# EAGLE design LiPoBBSupplyWithCharging (EAGLE 8.1.1)
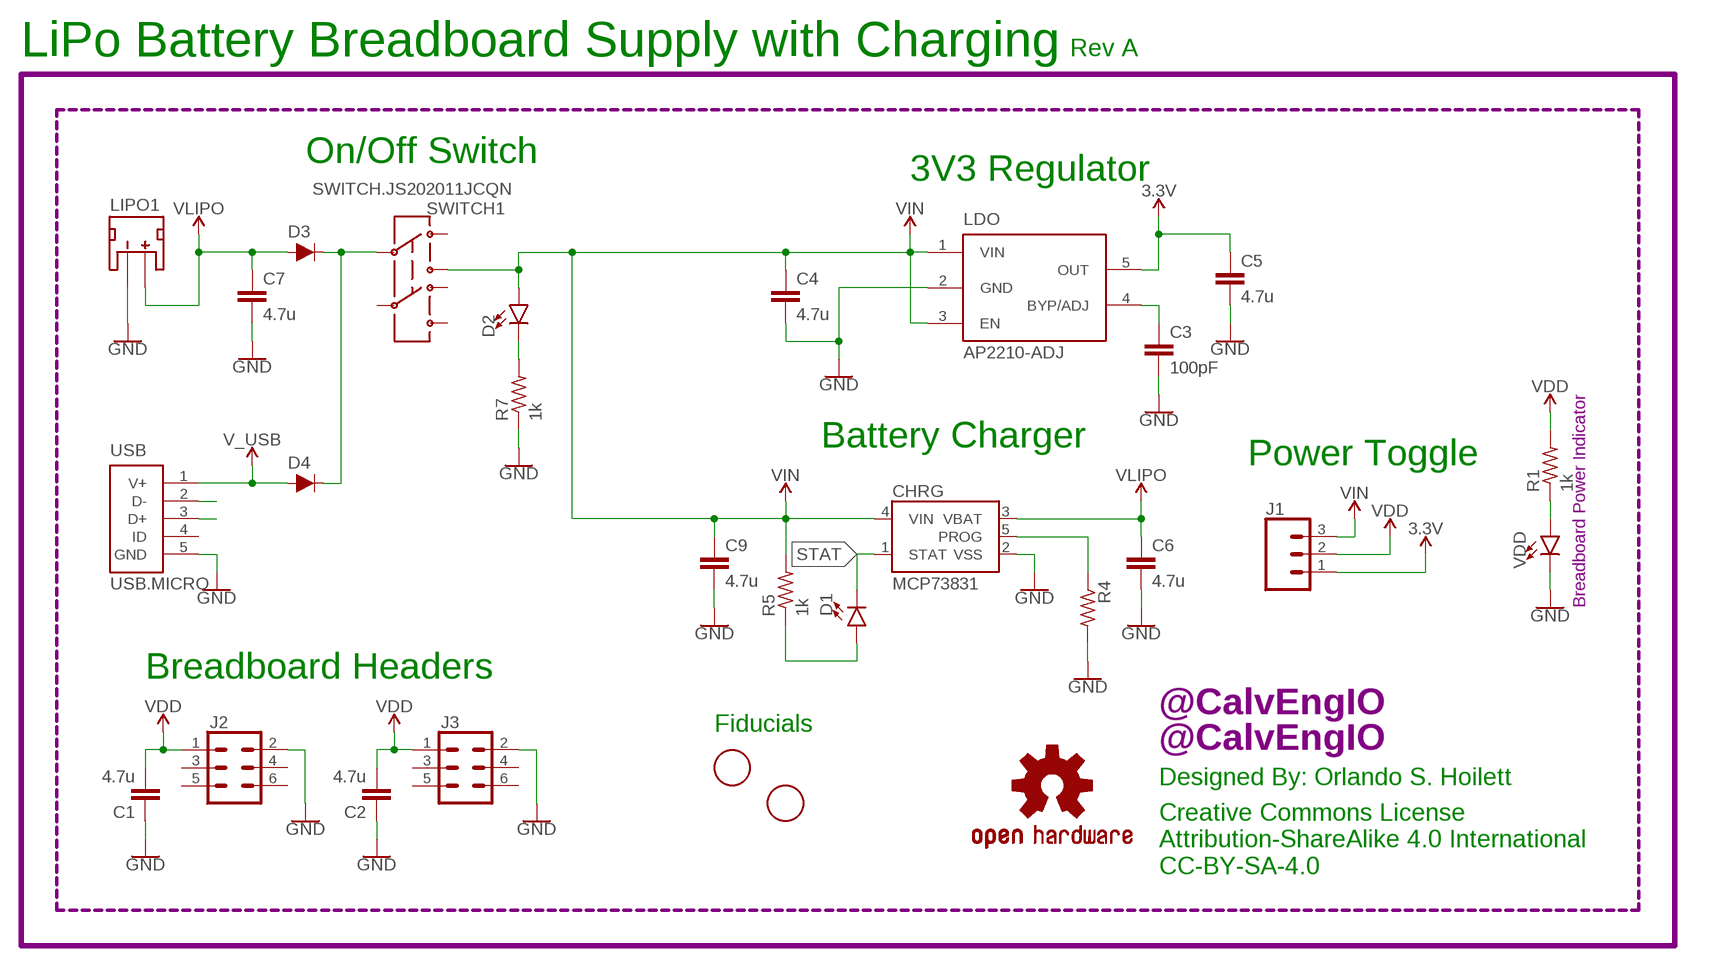
[diagram p0: schematic, sheet 1]

## Parts
C1  4.7u  CAPACITOR0603  [C0603]
C2  4.7u  CAPACITOR0603  [C0603]
C3  100pF  C-EUC0402  [C0402]
C4  4.7u  CAPACITOR0603  [C0603]
C5  4.7u  CAPACITOR0603  [C0603]
C6  4.7u  CAPACITOR0603  [C0603]
C7  4.7u  CAPACITOR0603  [C0603]
C9  4.7u  CAPACITOR0603  [C0603]
CHRG  MCP73831  [SOT23-5]
D1  LED0603  [LED-0603]
D2  LED0603  [LED-0603]
D3  DIODE-BAS16J  [SOD-323]
D4  DIODE-BAS16J  [SOD-323]
FD1  FIDUCIAL  [FIDUCIAL_1MM]
FD2  FIDUCIAL  [FIDUCIAL_1MM]
J1  CONN_03  [1X03]
J2  CONN_03X22X3_SILK_MALE_PTH  [2X3]
J3  CONN_03X22X3_SILK_MALE_PTH  [2X3]
LDO  AP2210-ADJ  [SOT23-5]
LIPO1  JST_2MM_MALE  [JST-2-SMD]
LOGO1  OSHW-LOGOS  [OSHW-LOGO-S]
R1  1k  R-US_R0402  [R0402]
R4  RESISTOR0402  [R0402]
R5  1k  RESISTOR0402  [R0402]
R7  1k  RESISTOR0402  [R0402]
SWITCH1  SWITCH.JS202011JCQN  [SWITCH.00]
U$1  HANDLE.1HANDLE.025  [HANDLE.025]
U$3  CALVENGIO_HANDLEHANDLE.1  [CALVENGIO_HANDLE.1]
USB  USB.MICRO  [USB-MICRO-01]
VDD  LED0603  [LED-0603]

## Nets
3.3V: C5.1 J1.1 LDO.5(OUT)
GND: C1.1 C2.1 C3.2 C4.2 C5.2 C6.2 C7.2 C9.2 CHRG.2(VSS) J2.2 J3.2 LDO.2(GND) LIPO1.1(-) R4.2 R7.1 USB.5(GND) VDD.C
N$2: R1.1 VDD.A
N$3: D2.C R7.2
N$4: C3.1 LDO.4(BYP/ADJ)
N$6: D1.A R5.1
N$8: CHRG.5(PROG) R4.1
N$9: D3.C D4.C SWITCH1.2
N$13: USB.3(D+)
N$17: USB.2(D-)
STAT: CHRG.1(STAT) D1.C
V_USB: D4.A USB.1(V+)
VDD: C1.2 C2.2 J1.2 J2.1 J3.1 R1.2
VIN: C4.1 C9.1 CHRG.4(VIN) D2.A J1.3 LDO.1(VIN) LDO.3(EN) R5.2 SWITCH1.3
VLIPO: C6.1 C7.1 CHRG.3(VBAT) D3.A LIPO1.2(+)
Unconnected: J2.3 J2.4 J2.5 J2.6 J3.3 J3.4 J3.5 J3.6 LIPO1.NC1(PAD1) LIPO1.NC2(PAD2) SWITCH1.1 SWITCH1.5 SWITCH1.6 SWITCH1.7 USB.4(ID)

## Notes on the sheet
- LiPo Battery Breadboard Supply with Charging | Rev A
- On/Off Switch
- 3V3 Regulator
- Battery Charger
- Power Toggle
- Breadboard Power Indicator
- Breadboard Headers
- Fiducials
- Designed By: Orlando S. Hoilett
- Creative Commons License
  Attribution-ShareAlike 4.0 International
  CC-BY-SA-4.0

## Library data of the parts
C1 C2 C4-C7 C9 = CalvEngIO-Passives:CAPACITOR
C3 = resistor:C-EU: CAPACITOR, European symbol
CHRG = CalvEngIO-Power:MCP73831: MCP73831T Li-Ion, Li-Pol Controller Miniature single cell, fully integrated Li-Ion, Li-polymer charge management controller Datasheet <http://ww1.microchip.com/downloads/en/DeviceDoc/20001984g.pdf> SparkFun Products: SparkFun ESP32 Thing <https://www.sparkfun.com/products/13907> SparkFun 9DoF Razor IMU M0 <https://www.sparkfun.com/products/14001>; PROD_ID: IC-09995
D1 D2 VDD = CalvEngIO-LED:LED: LED (Generic) Standard schematic elements and footprints for 5mm, 3mm, 1206, and 0603 sized LEDs. Generic LEDs with no color specified.
D3 D4 = CalvEngIO-DiscreteSemi:DIODE: Diode These are standard reverse protection diodes and small signal diodes. SparkFun Products: SparkFun SparkPunk Sound Kit <https://www.sparkfun.com/products/11177> SparkFun ESP8266 Thing <https://www.sparkfun.com/products/13231>; PROD_ID: DIO-09646
FD1 FD2 = adafruit:FIDUCIAL: For use by pick and place machines to calibrate the vision/machine, 1mm By microbuilder.eu
J1 = SparkFun-Connectors:CONN_03: Multi connection point. Often used as Generic Header-pin footprint for 0.1 inch spaced/style header connections On any of the 0.1 inch spaced packages, you can populate with these: Break Away Headers - Straight <https://www.sparkfun.com/products/116> (PRT-00116) Break Away Male Headers - Right Angle <https://www.sparkfun.com/products/553> (PRT-00553) Female Headers <https://www.sparkfun.com/products/115> (PRT-00115) Break Away Headers - Machine Pin <https://www.sparkfun.com/products/117> (PRT-00117) Break Away Female Headers - Swiss Machine Pin <https://www.sparkfun.com/products/743> (PRT-00743) Stackable Header - 3 Pin (Female, 0.1") <https://www.sparkfun.com/products/13875> (PRT-13875) For SCREWTERMINALS and SPRING TERMINALS visit here: Screw Terimnals on SparkFun.com <https://www.sparkfun.com/search/results?term=Screw+Terminals> (5mm/3.5mm/2.54mm spacing) This device is also useful as a general connection point to wire up your design to another part of your project. Our various solder wires solder well into these plated through hole pads. Hook-Up Wire - Assortment (Stranded, 22 AWG) <https://www.sparkfun.com/products/11375> (PRT-11375) Hook-Up Wire - Assortment (Solid Core, 22 AWG) <https://www.sparkfun.com/products/11367> (PRT-11367) View the entire wire category on our website here <https://www.sparkfun.com/categories/141> Special notes: Molex polarized connector foot print use with SKU : PRT-08232 with associated crimp pins and housings.
J2 J3 = CalvEngIO-Connectors:CONN_03X2: Multi connection point. Often used as Generic Header-pin footprint for 0.1 inch spaced/style header connections You can populate with any combo of single row headers, but if you'd like an exact match, check these: Header - 2x3 (Male, 0.1") <https://www.sparkfun.com/products/12807> (PRT-12807) Header - 2x3 (Female, 0.1") <https://www.sparkfun.com/products/13010> (PRT-13010) 2x3 Pin Shrouded Header <https://www.sparkfun.com/products/10877> (PRT-10877) On any of the 0.1 inch spaced packages, you can populate with these: Break Away Headers - Straight <https://www.sparkfun.com/products/116> (PRT-00116) Break Away Male Headers - Right Angle <https://www.sparkfun.com/products/553> (PRT-00553) Female Headers <https://www.sparkfun.com/products/115> (PRT-00115) Break Away Headers - Machine Pin <https://www.sparkfun.com/products/117> (PRT-00117) Break Away Female Headers - Swiss Machine Pin <https://www.sparkfun.com/products/743> (PRT-00743) Special note: the shrouded connector mates well with our 3x2 ribbon cables: Ribbon Crimp Connector - 6-pin (2x3, Female) <https://www.sparkfun.com/products/10651> (PRT-10651) Ribbon Cable - 6 wire (15ft) <https://www.sparkfun.com/products/10646> (PRT-10646); PROD_ID: CONN-09701
LDO = CalvEngIO-Power:AP2210-ADJ
LIPO1 = CalvEngIO-Connectors:JST_2MM_MALE: JST 2MM MALE RA CONNECTOR Two pin, compact surface mount connector. Commonly used as a battery input connection point. We really like the solid locking feeling and high current rating on these small connectors. We use these all the time as battery connectors. Mates to single-cell LiPo batteries. Here is the connector we sell at SparkFun: JST Right Angle Connector - White <https://www.sparkfun.com/products/8612> (PRT-08612) Datasheet <http://www.sparkfun.com/datasheets/Prototyping/Connectors/JST-Horizontal.pdf> It was used on these SparkFun products: SparkFun MOSFET Power Controller <https://www.sparkfun.com/products/11214> (PRT-11214) SparkFun Battery Babysitter - LiPo Battery Manager <https://www.sparkfun.com/products/13777> (PRT-13777) And many, many others that required a lipo battery connection.; PROD_ID: CONN-11443; SF_ID: PRT-08612
LOGO1 = SparkFun-Aesthetics:OSHW-LOGO: Open-Source Hardware (OSHW) Logo This logo indicates the piece of hardware it is found on incorporates a OSHW license and/or adheres to the definition of open source hardware found here: http://freedomdefined.org/OSHW
R1 = resistor:R-US_: RESISTOR, American symbol
R4 R5 R7 = CalvEngIO-Passives:RESISTOR
SWITCH1 = CalvEngIO-Switches:SWITCH.JS202011JCQN
U$1 = CalvEngIO-Logos:HANDLE.1
U$3 = CalvEngIO-Logos:CALVENGIO_HANDLE
USB = CalvEngIO-Connectors:USB.MICRO: DigiKey PN: 609-4613-1-ND

## Board
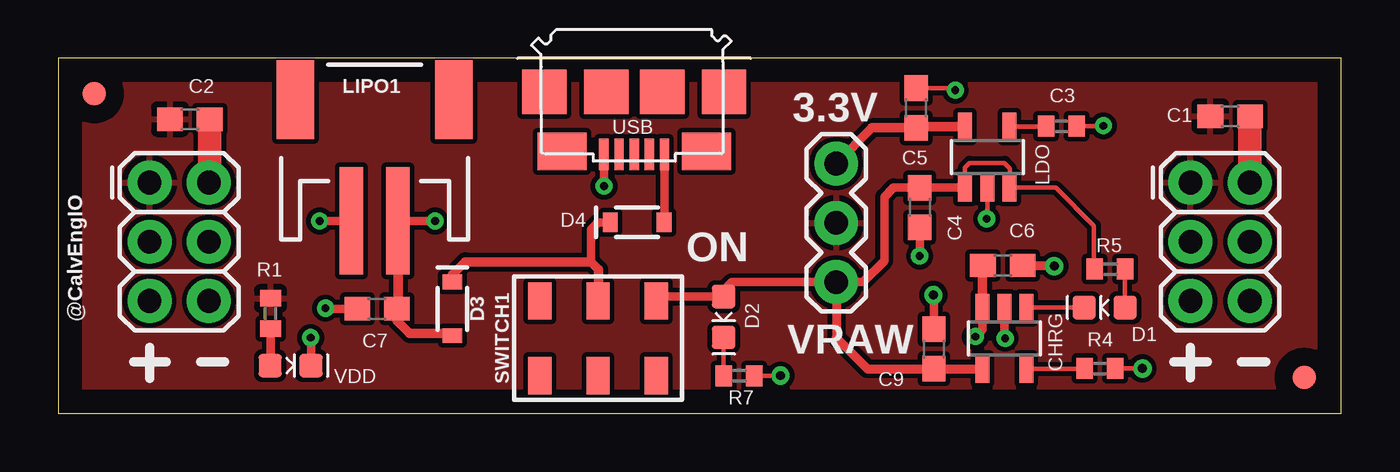
[diagram p1: board, top side]
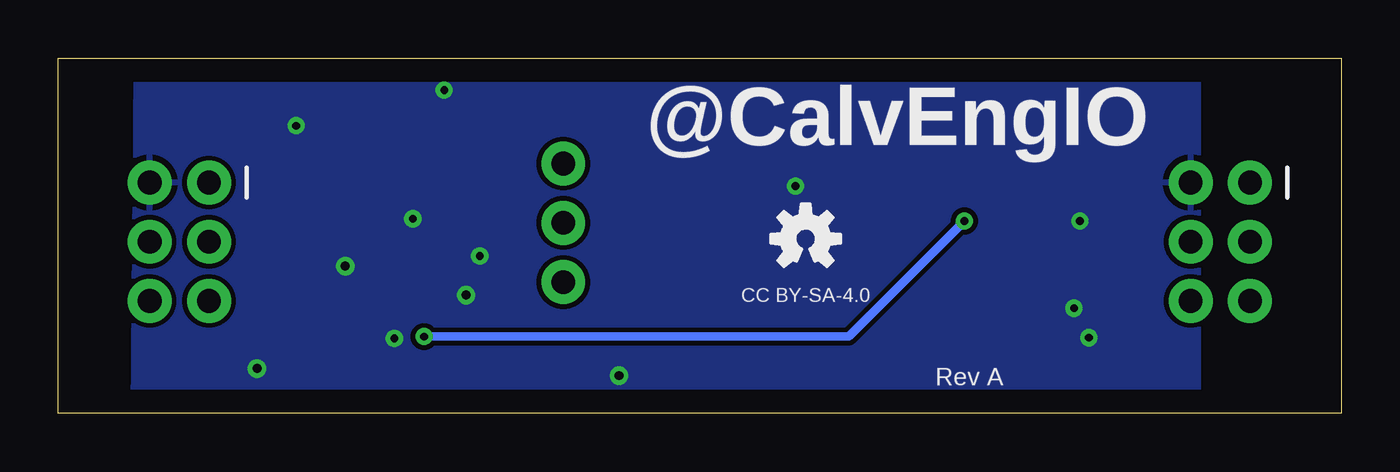
[diagram p2: board, bottom side, seen from below]

Size 55 x 15.24 mm. Coordinates in mm from the lower left corner, seen from the top.
Outline: 0,0 55,0 55,15.24 0,15.24 0,0
Copper layers (1*16): Top 0.035mm / dielectric 1.5mm / Bottom 0.035mm
Design rules "default": minimum track width 10mil, minimum drill 24mil, track to track 8mil, track to pad 8mil, pad to pad 8mil, via to via 8mil, smd to smd 8mil, copper to edge 40mil, drill to drill 8mil, minimum pad ring 10mil, minimum via ring 8mil, stop-mask expansion 4mil, vias tented up to drill 0mil, thermal gap 10mil

### Footprints (pad centres in the part's own frame; a part is rotated, then mirrored left to right if it is on the bottom)
C0603 = smd 1.1 x 1: 1 -0.85,0; 2 0.85,0
C0402 = smd 0.7 x 0.9: 1 -0.65,0; 2 0.65,0
SOT23-5 = smd 0.6 x 1.2: 1 -0.95,-1.306; 2 0,-1.306; 3 0.95,-1.306; 4 0.95,1.306; 5 -0.95,1.306
LED-0603 = smd 1 x 1: A -0.877,0; C 0.877,0
SOD-323 = smd 0.63 x 0.83: A 1.15,0; C -1.15,0
FIDUCIAL_1MM = smd 1 x 1: 1 0,0
1X03 = drill 1.016 pad 1.88: 1 0,0; 2 2.54,0; 3 5.08,0
2X3 = drill 1.016 pad 1.88: 1 0,0; 2 0,2.54; 3 2.54,0; 4 2.54,2.54; 5 5.08,0; 6 5.08,2.54
JST-2-SMD = smd 1 x 4.6: 1 -1,-3.7; 2 1,-3.7 | smd 1.6 x 3.4: NC1 -3.4,1.5; NC2 3.4,1.5
R0402 = smd 0.7 x 0.9: 1 -0.65,0; 2 0.65,0
SWITCH.00 = smd 1 x 1.6: 1 -2.5,1.6; 2 0,1.6; 3 2.5,1.6; 5 -2.5,-1.6; 6 0,-1.6; 7 2.5,-1.6
USB-MICRO-01 = smd 0.4 x 1.35: 1 -1.3,2.675; 2 -0.65,2.675; 3 0,2.675; 4 0.65,2.675; 5 1.3,2.675 | smd 1.9 x 1.9: SOLDER-1 -3.85,0; SOLDER-2 -1.2,0; SOLDER-3 1.2,0; SOLDER-4 3.85,0 | smd 2.1 x 1.6: SOLDER-5 -3.1,2.55; SOLDER-6 3.1,2.55

### Placement (x,y rotation side)
C1  50.24,12.75 180 top
C2  5.64,12.62 180 top
C3  43,12.32 0 top
C4  36.93,8.84 270 top
C5  36.78,13.11 90 top
C6  40.49,6.35 0 top
C7  13.67,4.5 180 top
C9  37.54,2.77 90 top
CHRG  40.56,3.23 180 top
D1  44.86,4.55 180 top
D2  28.52,4.14 270 top
D3  16.89,4.5 270 top
D4  24.82,8.2 0 top
FD1  1.55,13.72 0 top
FD2  53.42,1.55 0 top
J1  33.35,10.72 270 top
J2  3.91,9.91 270 top
J3  48.54,9.91 270 top
LDO  39.83,11 0 top
LIPO1  13.56,11.96 0 top
LOGO1  22.96,7.49 0 bottom
R1  9.09,4.29 90 top
R4  44.65,1.93 0 top
R5  45.09,6.2 180 top
R7  29.18,1.63 180 top
SWITCH1  23.14,3.23 0 top
U$1  0.41,6.86 270 top
U$3  19.66,12.78 0 bottom
USB  24.69,13.79 180 top
VDD  9.96,2.06 0 top

### Tracks (layer width: path | path; a pad name or v marks a point on that pad's centre or on a via)
3.3V
  Top 0.406: LDO.5 36.83,12.3 C5.1 34.89,12.26 J1.1
GND  (via drill 0.33, 0.38)
  Top 0.203: R7.1 v30.96,1.63 | R4.2 v46.48,1.93 | C3.2 44.78,12.32 v44.81,12.34 | C5.2 38.37,13.96 v38.46,13.87 | LDO.2 39.83,8.38 v39.8,8.36
  Top 0.356: CHRG.2 40.56,3.25 v40.59,3.23 | C9.2 37.54,5.05 v37.52,5.08 | C4.2 v36.93,6.76 | LIPO1.1 v11.21,8.26 v11.2,8.26 | C7.2 11.48,4.5 v11.46,4.52 | VDD.C 10.83,3.24 v10.82,3.25 | USB.5 v23.39,9.76 v23.39,9.75
  Top 0.381: C6.2 42.67,6.35 v42.7,6.33
  Top 1.016: C1.1 51.09,9.92 J3.2 | C2.1 6.49,9.94 J2.2
  pour Bottom (isolate 0.203): 6.1,17.14 51.66,17.14 51.82,0 6.1,0
N$2
  Top 0.356: R1.1 9.09,2.07 VDD.A
N$3
  Top 0.203: D2.C R7.2
N$4
  Top 0.203: LDO.4 42.34,12.3 C3.1
N$6
  Top 0.203: R5.1 D1.A
N$8
  Top 0.203: CHRG.5 R4.1
N$9
  Top 0.356: 22.84,6.5 22.84,7.9 23.14,8.2 D4.C
  Top 0.406: D3.C 16.89,5.94 17.45,6.5 22.84,6.5 23.16,6.17 23.16,4.85 SWITCH1.2
STAT
  Top 0.203: D1.C 41.53,4.55 CHRG.1
V_USB
  Top 0.356: USB.1 25.99,8.23 D4.A
VDD
  pour Top (isolate 0.203): 0,16.28 55,16.28 55,0 0,0
VIN
  Top 0.203: LDO.1 38.88,10.56 39.06,10.74 40.56,10.74 40.79,10.52 40.79,9.71 LDO.3 42.76,9.69 44.4,8.05 44.4,6.23 R5.2
  Top 0.356: SWITCH1.3 25.83,5.02 D2.A 28.52,5.28 28.88,5.64 J1.3 34.49,5.64 35.41,6.55 35.41,9.3 35.81,9.7 36.92,9.7 C4.1 LDO.1
  Top 0.381: J1.3 33.35,3.25 34.7,1.91 37.53,1.91 C9.1 CHRG.4
  Top 0.406: 33.47,5.64 J1.3
VLIPO  (via drill 0.33)
  Top 0.356: CHRG.3 39.61,3.6 v39.32,3.3 | v16.15,8.26 14.57,8.26 LIPO1.2
  Top 0.406: CHRG.3 39.61,6.33 C6.1 | LIPO1.2 14.56,4.54 C7.1 14.52,3.98 15.06,3.43 16.81,3.43 D3.A
  Bottom 0.356: v39.32,3.3 21.11,3.3 v16.15,8.26

### Text on the board
bPlace: CC BY-SA-4.0 | Rev A
_tsilk: 3.3V | ON | VRAW